# EAGLE design WiFi_Switch (EAGLE 9.3.1)
The Schematis for the WiFi Switch project.
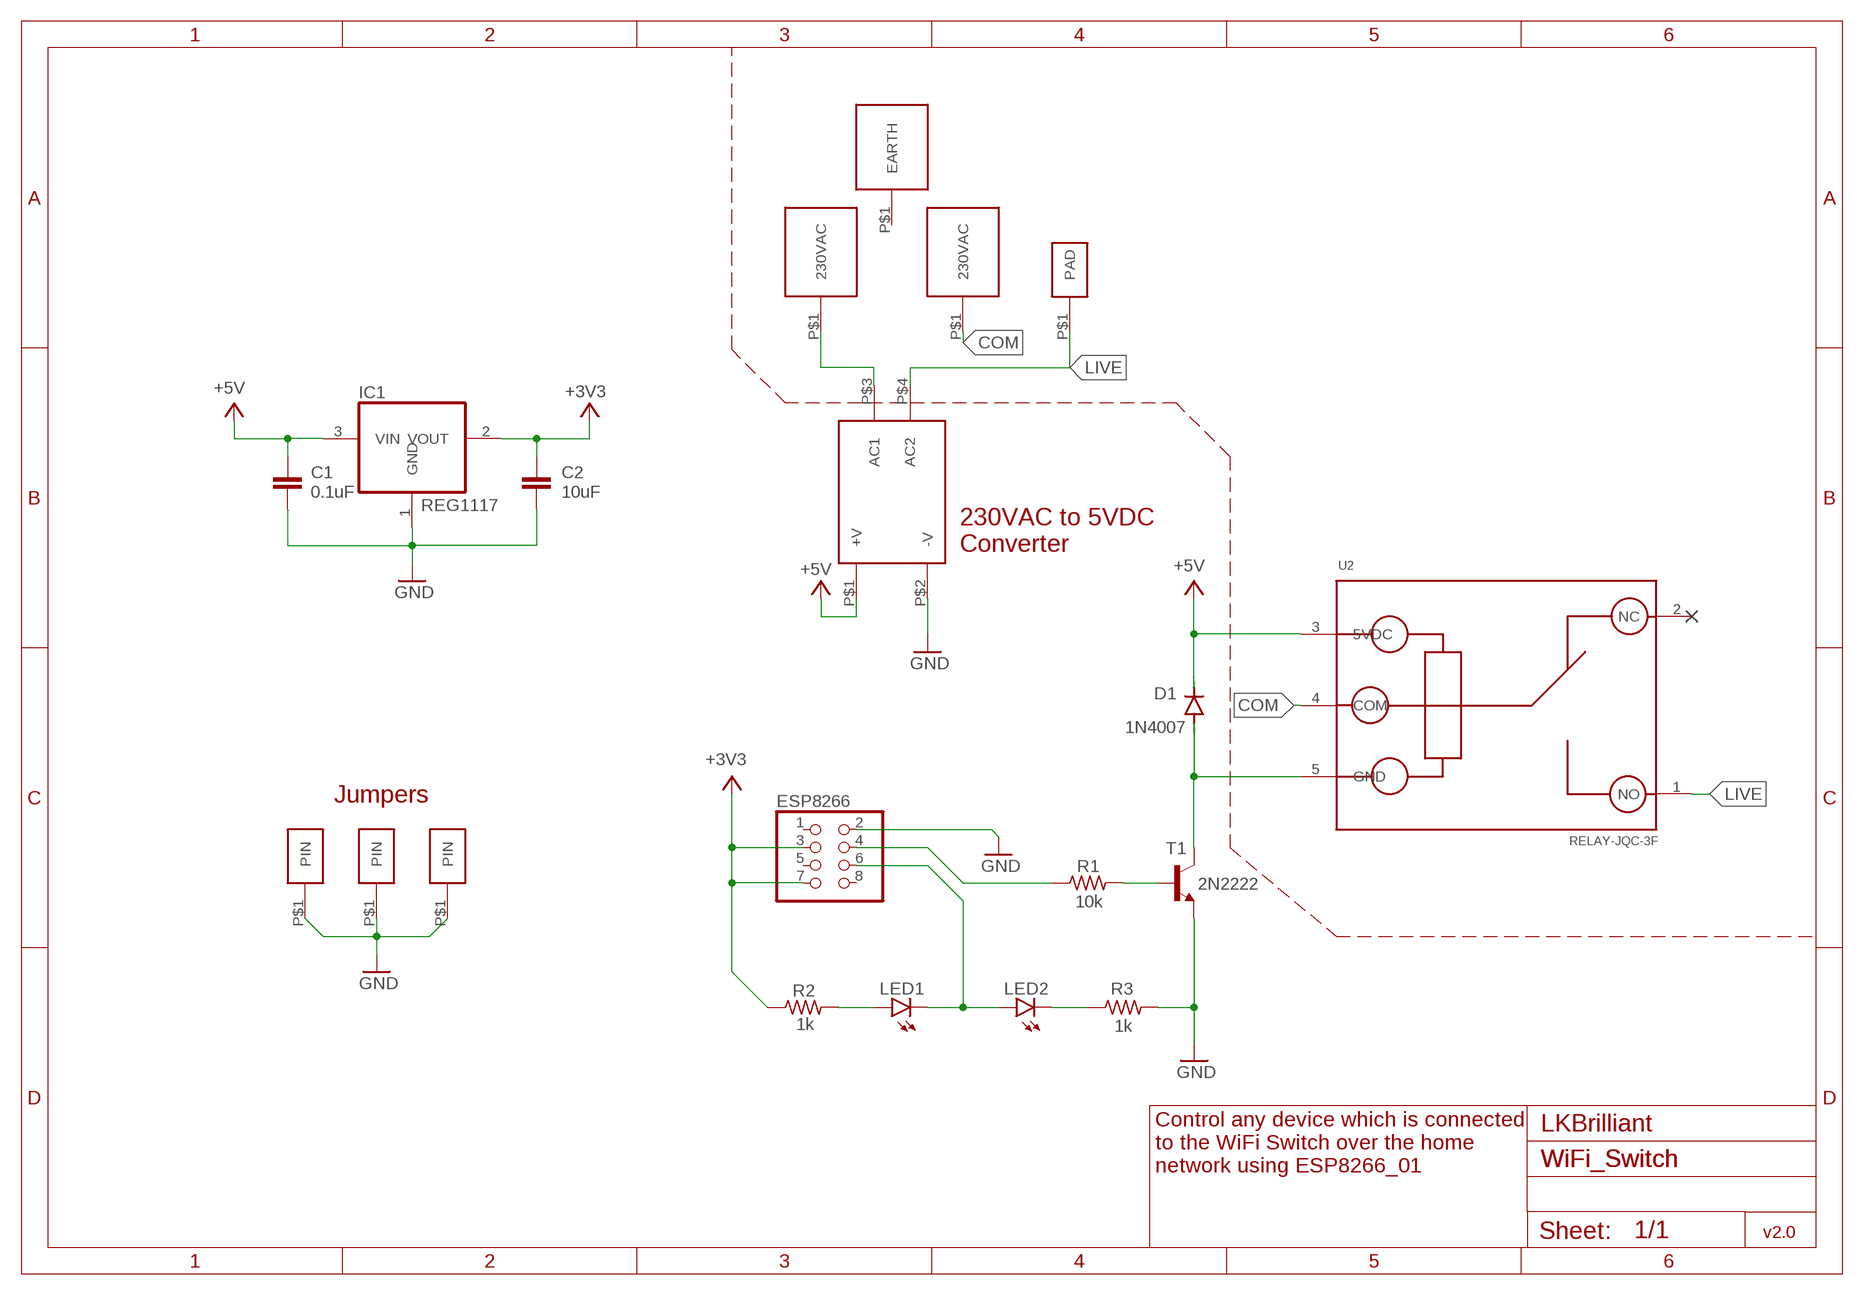
[diagram p0: schematic, sheet 1]

## Parts
C1  0.1uF  C-EUC0805  [C0805]
C2  10uF  C-EUC0805  [C0805]
D1  1N4007  DIODE-DO214AC  [DO214AC]
ESP8266  PINHD-2X4  [2X04]
GND  1-PIN  [1-PIN]
IC1  REG1117  [SOT223]
L  230VAC_PAD  [11X9_SMD_PAD]
LED1  LEDCHIPLED_0603  [CHIPLED_0603]
LED2  LEDCHIPLED_0603  [CHIPLED_0603]
N  230VAC_PAD  [11X9_SMD_PAD]
R1  10k  R-US_R0805  [R0805]
R2  1k  R-US_R0805  [R0805]
R3  1k  R-US_R0805  [R0805]
T1  2N2222  -NPN-SOT23-EBC  [SOT23-EBC]
U1  230VAC/5VDC_CONVERTER  [REG_BLOCK]
U2  RELAY-JQC-3F  [JQC-3F]
U$1  1-PIN  [1-PIN]
U$4  EARTH_PAD  [17X8_PAD]
U$5  EXT_PAD  [4X2_PAD]
U$6  1-PIN  [1-PIN]

## Nets
+3V3: C2.1 ESP8266.3 ESP8266.7 IC1.2(VOUT) R2.1
+5V: C1.1 D1.C IC1.3(VIN) U1.P$1(+V) U2.3(5VDC)
COM: L.P$1(230VAC) U2.4(COM)
GND: C1.2 C2.2 ESP8266.2 GND.P$1(PIN) IC1.1(GND) R3.2 T1.E U1.P$2(-V) U$1.P$1(PIN) U$6.P$1(PIN)
LIVE: U1.P$4(AC2) U2.1(NO) U$5.P$1(PAD)
N$1: LED1.A R2.2
N$2: N.P$1(230VAC) U1.P$3(AC1)
N$5: D1.A T1.C U2.5(GND)
N$6: LED2.C R3.1
N$7: R1.2 T1.B
N$8: ESP8266.6 LED1.C LED2.A
SIGNAL: ESP8266.4 R1.1
Unconnected: ESP8266.1 ESP8266.5 ESP8266.8 U2.2(NC) U$4.P$1(EARTH)

## Notes on the sheet
- 230VAC to 5VDC 
  Converter
- Jumpers
- LKBrilliant
- Control any device which is connected 
  to the WiFi Switch over the home 
  network using ESP8266_01
- v2.0

## Library data of the parts
C1 C2 = rcl:C-EU: CAPACITOR, European symbol; SPICEPREFIX: C
D1 = diode:DIODE-: DIODE
ESP8266 = pinhead:PINHD-2X4: PIN HEADER
GND U$1 U$6 = MyCustomLibrary:1-PIN
IC1 = burr-brown:REG1117: 800mA and 1A Low Dropout (LDO) Positive Regulator 1.8V, 2.5V, 2.85V, 3.3V, 5V, and Adj; MPN: REG1117; OC_FARNELL: 1097566; OC_NEWARK: 14P6981
L N = MyCustomLibrary:230VAC_PAD
LED1 LED2 = led:LED: LED OSRAM: - CHIPLED LG R971, LG N971, LY N971, LG Q971, LY Q971, LO R971, LY R971 LH N974, LH R974 LS Q976, LO Q976, LY Q976 LO Q996 - Hyper CHIPLED LW Q18S LB Q993, LB Q99A, LB R99A - SideLED LS A670, LO A670, LY A670, LG A670, LP A670 LB A673, LV A673, LT A673, LW A673 LH A674 LY A675 LS A676, LA A676, LO A676, LY A676, LW A676 LS A679, LY A679, LG A679 - Hyper Micro SIDELED® LS Y876, LA Y876, LO Y876, LY Y876 LT Y87S - SmartLED LW L88C, LW L88S LB L89C, LB L89S, LG L890 LS L89K, LO L89K, LY L89K LS L896, LA L896, LO L896, LY L896 - TOPLED LS T670, LO T670, LY T670, LG T670, LP T670 LSG T670, LSP T670, LSY T670, LOP T670, LYG T670 LG T671, LOG T671, LSG T671 LB T673, LV T673, LT T673, LW T673 LH T674 LS T676, LA T676, LO T676, LY T676, LB T676, LH T676, LSB T676, LW T676 LB T67C, LV T67C, LT T67C, LS T67K, LO T67K, LY T67K, LW E67C LS E67B, LA E67B, LO E67B, LY E67B, LB E67C, LV E67C, LT E67C LW T67C LS T679, LY T679, LG T679 LS T770, LO T770, LY T770, LG T770, LP T770 LB T773, LV T773, LT T773, LW T773 LH T774 LS E675, LA E675, LY E675, LS T675 LS T776, LA T776, LO T776, LY T776, LB T776 LHGB T686 LT T68C, LB T68C - Hyper Mini TOPLED® LB M676 - Mini TOPLED Santana® LG M470 LS M47K, LO M47K, LY M47K Source: http://www.osram.convergy.de LUXEON: - LUMILED® LXK2-PW12-R00, LXK2-PW12-S00, LXK2-PW14-U00, LXK2-PW14-V00 LXK2-PM12-R00, LXK2-PM12-S00, LXK2-PM14-U00 LXK2-PE12-Q00, LXK2-PE12-R00, LXK2-PE12-S00, LXK2-PE14-T00, LXK2-PE14-U00 LXK2-PB12-K00, LXK2-PB12-L00, LXK2-PB12-M00, LXK2-PB14-N00, LXK2-PB14-P00, LXK2-PB14-Q00 LXK2-PR12-L00, LXK2-PR12-M00, LXK2-PR14-Q00, LXK2-PR14-R00 LXK2-PD12-Q00, LXK2-PD12-R00, LXK2-PD12-S00 LXK2-PH12-R00, LXK2-PH12-S00 LXK2-PL12-P00, LXK2-PL12-Q00, LXK2-PL12-R00 Source: www.luxeon.com KINGBRIGHT: KA-3528ASYC Source: www.kingbright.com
R1-R3 = resistor:R-US_: RESISTOR, American symbol
T1 = transistor:*-NPN-: NPN Transistror BF959 corrected 2008.03.06
U1 = MyCustomLibrary:230VAC/5VDC_CONVERTER
U2 = MyCustomLibrary:RELAY-JQC-3F
U$4 = MyCustomLibrary:EARTH_PAD
U$5 = MyCustomLibrary:EXT_PAD

## Board
The board layout for the WiFi Switch project.
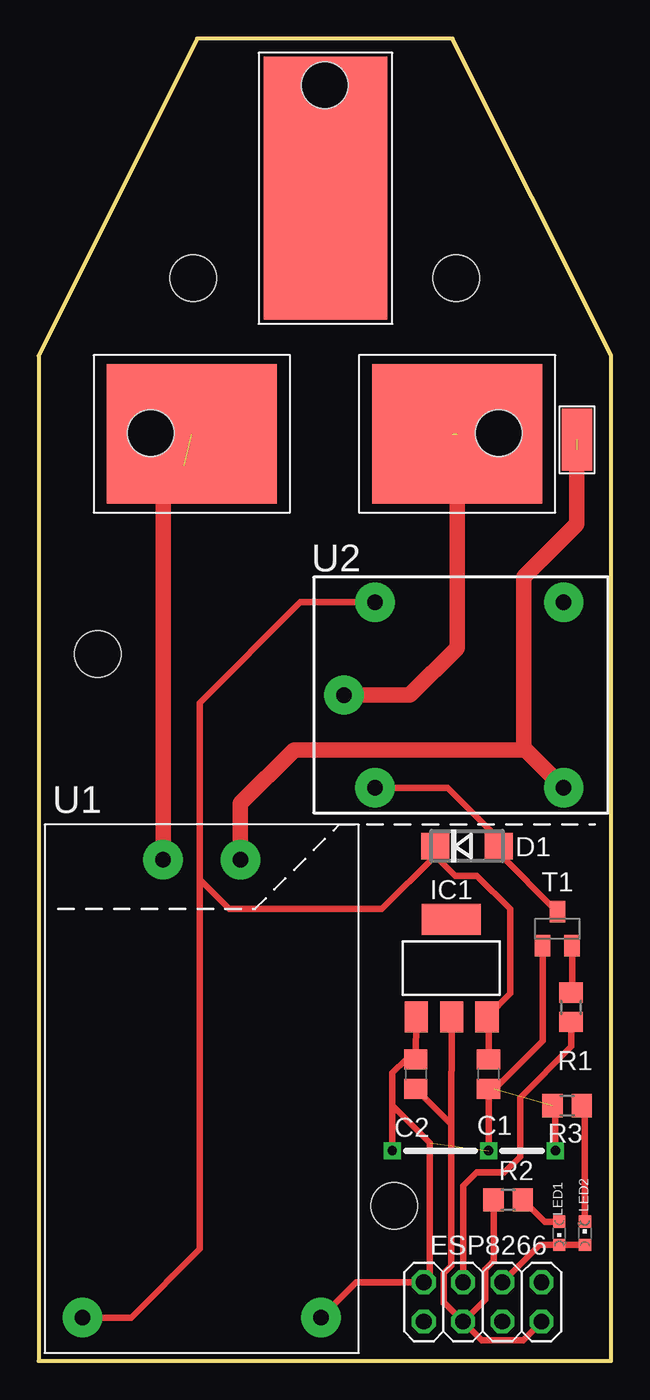
[diagram p1: board, top side]

Size 37 x 85.5 mm. Coordinates in mm from the lower left corner, seen from the top.
Outline: 0,65 0,0 37,0 37,65 26.75,85.5 10.25,85.5 0,65
Copper layers (1*16): Top 0.035mm / dielectric 1.5mm / Bottom 0.035mm
Design rules "default": minimum track width 6mil, minimum drill 0.35mm, track to track 6mil, track to pad 6mil, pad to pad 6mil, via to via 6mil, smd to smd 6mil, copper to edge 40mil, drill to drill 6mil, minimum pad ring 10mil, minimum via ring 8mil, stop-mask expansion 4mil, vias tented up to drill 0mil, thermal gap 10mil
Holes 3 mm at 27,70 10,70 29.75,60 18.5,82.5 7.25,60 3.81,45.72 22.99,10.03

### Footprints (pad centres in the part's own frame; a part is rotated, then mirrored left to right if it is on the bottom)
C0805 = smd 1.3 x 1.5: 1 -0.95,0; 2 0.95,0
DO214AC = smd 1.8 x 1.7: A 2.05,0; C -2.05,0
2X04 = drill 1.016 octagon: 1 -3.81,-1.27; 2 -3.81,1.27; 3 -1.27,-1.27; 4 -1.27,1.27; 5 1.27,-1.27; 6 1.27,1.27; 7 3.81,-1.27; 8 3.81,1.27
1-PIN = drill 0.6 square: P$1 0,0
SOT223 = smd 1.499 x 2.007: 1 -2.261,-3.15; 2 0.025,-3.15; 3 2.311,-3.15 | smd 3.81 x 2.007: 4 0,3.15
11X9_SMD_PAD = smd 11 x 9: P$1 0,0
CHIPLED_0603 = smd 0.8 x 0.8: A 0,-0.75; C 0,0.75
R0805 = smd 1.3 x 1.5: 1 -0.95,0; 2 0.95,0
SOT23-EBC = smd 1 x 1.4: B 0.95,-1.1; C 0,1.1; E -0.95,-1.1
REG_BLOCK = drill 1 pad 2.54: P$1 -7.7,-14.6; P$2 7.7,-14.6; P$3 -2.5,15; P$4 2.5,15
JQC-3F = drill 1 pad 2.54: 1 -6,-6; 2 6,-6; 3 6,6.2; 4 0,8.2; 5 -6,6.2
17X8_PAD = smd 17 x 8: P$1 0,0
4X2_PAD = smd 4 x 2: P$1 0,0

### Placement (x,y rotation side)
C1  29.08,18.54 270 top
C2  24.38,18.54 90 top
D1  27.69,33.27 0 top
ESP8266  28.7,3.81 0 top
GND  22.86,13.59 0 top
IC1  26.67,25.4 0 top
L  27.05,59.94 0 top
LED1  33.66,8.26 180 top
LED2  35.31,8.26 0 top
N  9.91,59.94 0 top
R1  34.42,22.86 90 top
R2  30.35,10.41 0 top
R3  34.16,16.51 180 top
T1  33.53,27.94 0 top
U1  10.54,17.4 0 top
U2  27.94,43.05 90 top
U$1  33.4,13.59 0 top
U$4  18.54,75.82 90 top
U$5  34.8,59.56 90 top
U$6  29.08,13.59 0 top

### Tracks (layer width: path | path; a pad name or v marks a point on that pad's centre or on a via)
+3V3
  Top 0.406: IC1.2 26.68,15.24 | 26.68,15.24 26.67,6.35 26.67,6.15 26.19,5.67 26.19,3.73 26.24,3.73 ESP8266.3 | C2.1 26.68,15.29 26.68,15.24 | ESP8266.3 28.63,1.35 31.32,1.35 ESP8266.7 | ESP8266.3 28.85,3.96 28.85,5.92 29.4,6.47 R2.1
+5V
  Top 0.406: U1.P$1 5.97,2.8 10.41,7.24 10.41,31.11 | C1.1 29.08,22.15 IC1.3 30.48,23.75 30.48,29.21 28.32,31.37 26.92,31.37 25.64,32.66 | 25.64,32.66 D1.C | 10.41,31.11 12.32,29.21 22.19,29.21 25.64,32.66 | 10.41,31.11 10.41,42.55 16.92,49.05 U2.3
COM  (1 unrouted)
  Top 1.016: U2.4 24,43.05 27.05,46.1 27.05,58.42 26.73,58.75 26.73,59.94
GND  (2 unrouted)
  Top 0.406: U1.P$2 20.52,5.08 ESP8266.2 25.27,5.46 25.27,14.1 22.86,16.51 | T1.E 32.58,20.7 29.47,17.59 C1.2 U$6.P$1 | IC1.1 C2.2 23.75,19.49 22.86,18.61 22.86,16.51 | 22.86,16.51 GND.P$1 | U$1.P$1 33.4,16.32 R3.2
LIVE  (1 unrouted)
  Top 0.813: 34.8,58.93 34.29,58.42
  Top 1.016: U$5.P$1 34.8,54.1 31.37,50.67 31.37,39.62 U2.1 31.5,39.5 16.51,39.5 13.04,36.03 U1.P$4
N$1
  Top 0.406: R2.2 32.71,9.01 LED1.A
N$2  (1 unrouted)
  Top 1.016: U1.P$3 8.04,56.51 9.42,57.89
N$5
  Top 0.406: T1.C 29.74,32.83 D1.A 29.74,33.76 26.45,37.05 U2.5
N$6
  Top 0.406: R3.1 35.31,16.32 LED2.C
N$7
  Top 0.406: T1.B 34.48,23.87 R1.2
N$8
  Top 0.406: LED2.A LED1.C 32.4,7.5 ESP8266.6
SIGNAL
  Top 0.406: R1.1 34.42,20.32 31.11,17.02 31.11,13.21 30.1,12.19 28.32,12.19 27.43,11.3 ESP8266.4